# EAGLE design RCboat (EAGLE 9.6.2)
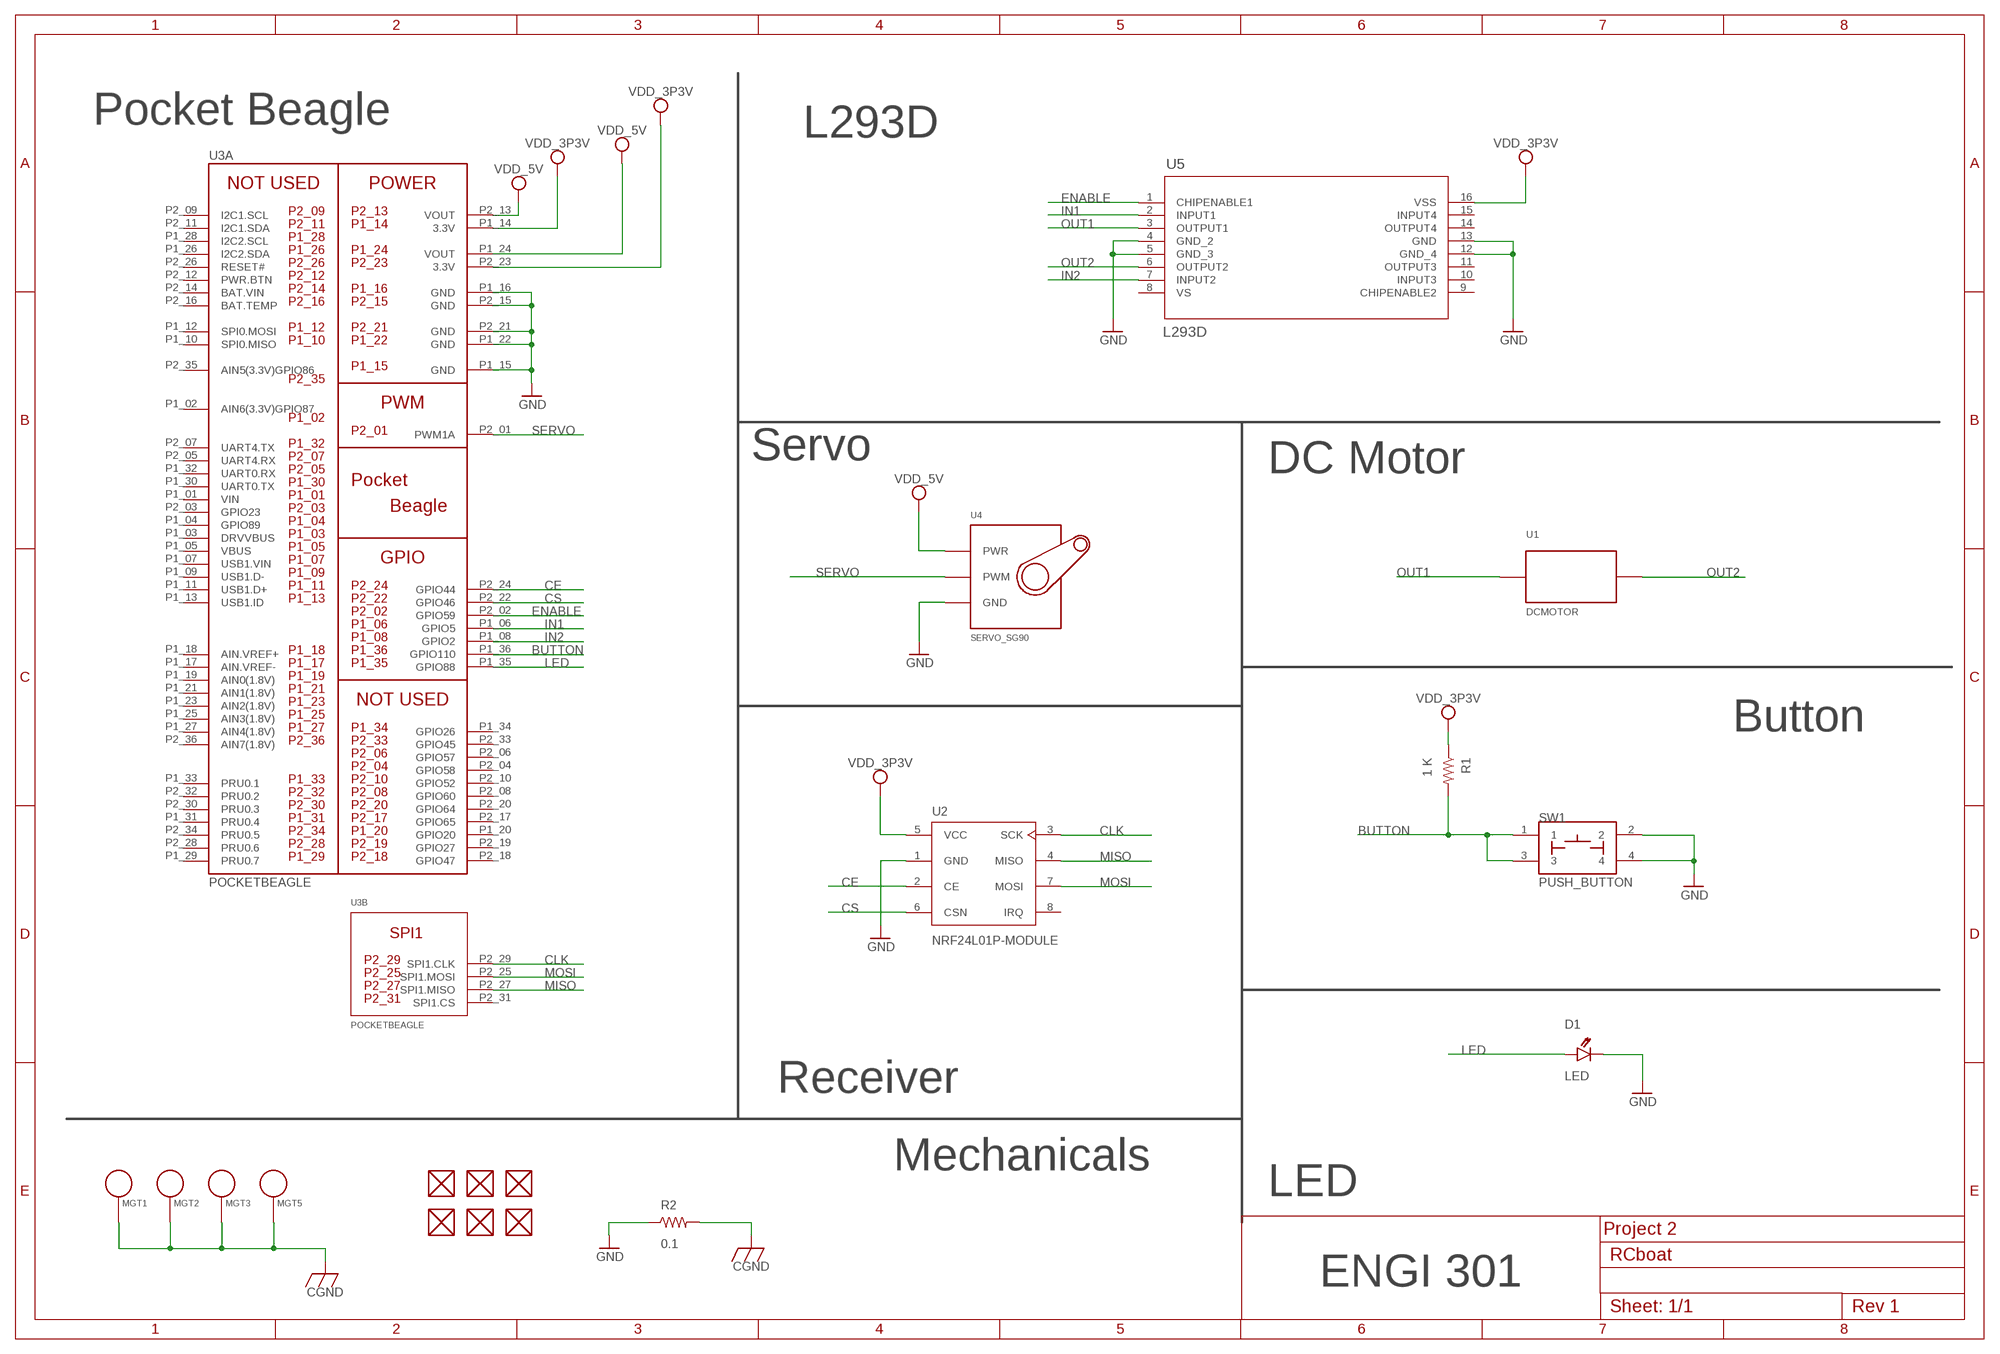
[diagram p0: schematic, sheet 1]

## Parts
D1  LED  [EIA-STD]
FUD1  FIDUCIAL  [FIDUCIAL_40MIL]
FUD2  FIDUCIAL  [FIDUCIAL_40MIL]
FUD3  FIDUCIAL  [FIDUCIAL_40MIL]
FUD4  FIDUCIAL  [FIDUCIAL_40MIL]
FUD5  FIDUCIAL  [FIDUCIAL_40MIL]
FUD6  FIDUCIAL  [FIDUCIAL_40MIL]
MGT1  MOUNTING_HOLE  [MOUNTING_HOLE]
MGT2  MOUNTING_HOLE  [MOUNTING_HOLE]
MGT3  MOUNTING_HOLE  [MOUNTING_HOLE]
MGT5  MOUNTING_HOLE  [MOUNTING_HOLE]
R1  1 K  R_R0603  [R0603]
R2  0.1  R_R0805  [R0805]
SW1  PUSH_BUTTON  [BUTTON_12.5MM]
U1  DCMOTOR  [DCMOTOR]
U2  NRF24L01P-MODULE  [NRF24L01P-MODULE]
U3  POCKETBEAGLE  [POCKETBEAGLE]
U4  SERVO_SG90  [SERVO-X1]
U5  L293D  [POWERDIP-16_STM]

## Nets
BUTTON: R1.2 SW1.1 SW1.3 U3.P1_36(A:GPIO110)
CE: U2.2(CE) U3.P2_24(A:GPIO44)
CGND: MGT1.P$1 MGT2.P$1 MGT3.P$1 MGT5.P$1 R2.2
CLK: U2.3(SCK) U3.P2_29(B:SPI1.CLK)
CS: U2.6(CSN) U3.P2_22(A:GPIO46)
ENABLE: U3.P2_02(A:GPIO59) U5.1(CHIPENABLE1)
GND: D1.CATHODE R2.1 SW1.2 SW1.4 U2.1(GND) U3.P1_15(A:GND) U3.P1_16(A:GND) U3.P1_22(A:GND) U3.P2_15(A:GND) U3.P2_21(A:GND) U4.GND U5.4(GND_2) U5.5(GND_3) U5.12(GND_4) U5.13(GND)
IN1: U3.P1_06(A:GPIO5) U5.2(INPUT1)
IN2: U3.P1_08(A:GPIO2) U5.7(INPUT2)
LED: D1.ANODE U3.P1_35(A:GPIO88)
MISO: U2.4(MISO) U3.P2_27(B:SPI1.MISO)
MOSI: U2.7(MOSI) U3.P2_25(B:SPI1.MOSI)
OUT1: U1.1(V1) U5.3(OUTPUT1)
OUT2: U1.2 U5.6(OUTPUT2)
SERVO: U3.P2_01(A:PWM1A) U4.SIG(PWM)
VDD_3P3V: R1.1 U2.5(VCC) U3.P1_14(A:3.3V) U3.P2_23(A:3.3V) U5.16(VSS)
VDD_5V: U3.P1_24(A:VOUT) U3.P2_13(A:VOUT) U4.PWR
Unconnected: FUD1.P$1 FUD2.P$1 FUD3.P$1 FUD4.P$1 FUD5.P$1 FUD6.P$1 U2.8(IRQ) U3.P1_02(A:AIN6(3.3V)GPIO87) U3.P1_03(A:DRVVBUS) U3.P1_04(A:GPIO89) U3.P1_05(A:VBUS) U3.P1_07(A:USB1.VIN) U3.P1_09(A:USB1.D-) U3.P1_10(A:SPI0.MISO) U3.P1_11(A:USB1.D+) U3.P1_12(A:SPI0.MOSI) U3.P1_13(A:USB1.ID) U3.P1_17(A:AIN.VREF-) U3.P1_18(A:AIN.VREF+) U3.P1_19(A:AIN0(1.8V)) U3.P1_20(A:GPIO20) U3.P1_21(A:AIN1(1.8V)) U3.P1_23(A:AIN2(1.8V)) U3.P1_25(A:AIN3(1.8V)) U3.P1_26(A:I2C2.SDA) U3.P1_27(A:AIN4(1.8V)) U3.P1_28(A:I2C2.SCL) U3.P1_29(A:PRU0.7) U3.P1_30(A:UART0.TX) U3.P1_31(A:PRU0.4) U3.P1_32(A:UART0.RX) U3.P1_33(A:PRU0.1) U3.P1_34(A:GPIO26) U3.P2_03(A:GPIO23) U3.P2_04(A:GPIO58) U3.P2_05(A:UART4.RX) U3.P2_06(A:GPIO57) U3.P2_07(A:UART4.TX) U3.P2_08(A:GPIO60) U3.P2_09(A:I2C1.SCL) U3.P2_10(A:GPIO52) U3.P2_11(A:I2C1.SDA) U3.P2_12(A:PWR.BTN) U3.P2_16(A:BAT.TEMP) U3.P2_17(A:GPIO65) U3.P2_18(A:GPIO47) U3.P2_19(A:GPIO27) U3.P2_20(A:GPIO64) U3.P2_26(A:RESET#) U3.P2_28(A:PRU0.6) U3.P2_30(A:PRU0.3) U3.P2_31(B:SPI1.CS) U3.P2_32(A:PRU0.2) U3.P2_33(A:GPIO45) U3.P2_34(A:PRU0.5) U3.P2_35(A:AIN5(3.3V)GPIO86) U3.P2_36(A:AIN7(1.8V)) U5.9(CHIPENABLE2) U5.10(INPUT3) U5.11(OUTPUT3) U5.14(OUTPUT4) U5.15(INPUT4)

## Notes on the sheet
- Pocket Beagle | L293D
- Servo | DC Motor
- Button
- Receiver
- Mechanicals
- LED
- Project 2
- ENGI 301
- 1/1

## Power pins joined to a net without a drawn wire
BAT.VIN: U3.P2_14(A:BAT.VIN)
VIN: U3.P1_01(A:VIN)
VS: U5.8(VS)

## Library data of the parts
D1 = Project2:LED: EIA-STD LED; LTST-C191TBKT
FUD1-FUD6 = Project2:FIDUCIAL
MGT1-MGT3 MGT5 = Project2:MOUNTING_HOLE: Chassis Mounting Hole w/GND connection ability
R1 R2 = Project2:R_: RESISTOR, American symbol
SW1 = Project2:PUSH_BUTTON
U1 = Project2:DCMOTOR
U2 = Project2:NRF24L01P-MODULE: NRF24L01P-MODULE
U3 = Project2:POCKETBEAGLE: Pocketbeagle
U4 = Project2:SERVO_SG90: 180 degree roatation SG90 Servo
U5 = Project2:L293D: L293D Motor Controller for DC motor; COPYRIGHT: Copyright (C) 2021 Ultra Librarian. All rights reserved.; MANUFACTURER_PART_NUMBER: L293D; MFR_NAME: STMicroelectronics

## Board
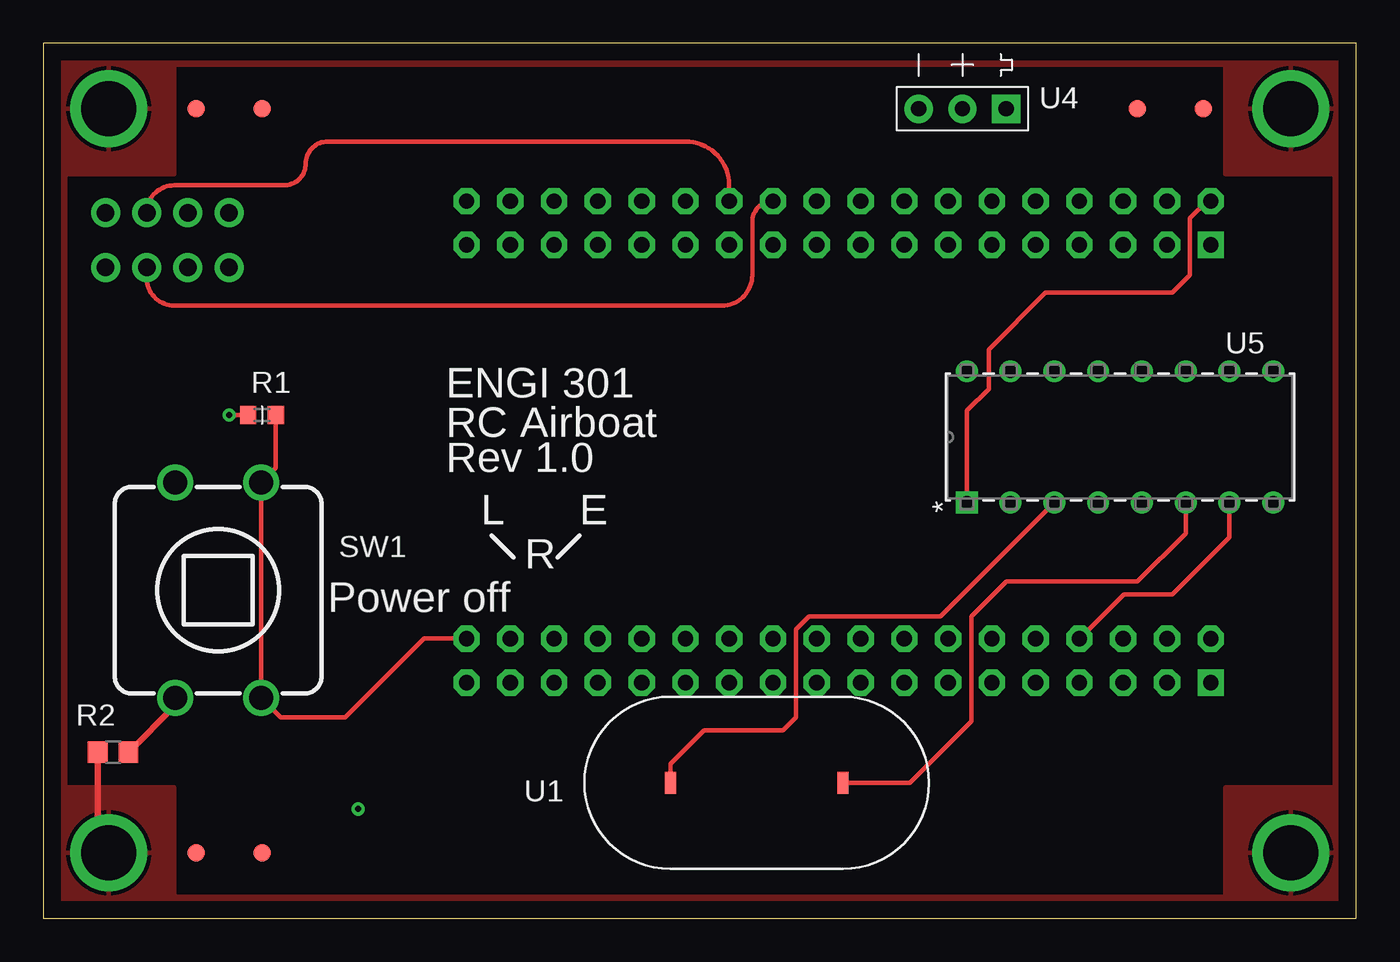
[diagram p1: board, top side]
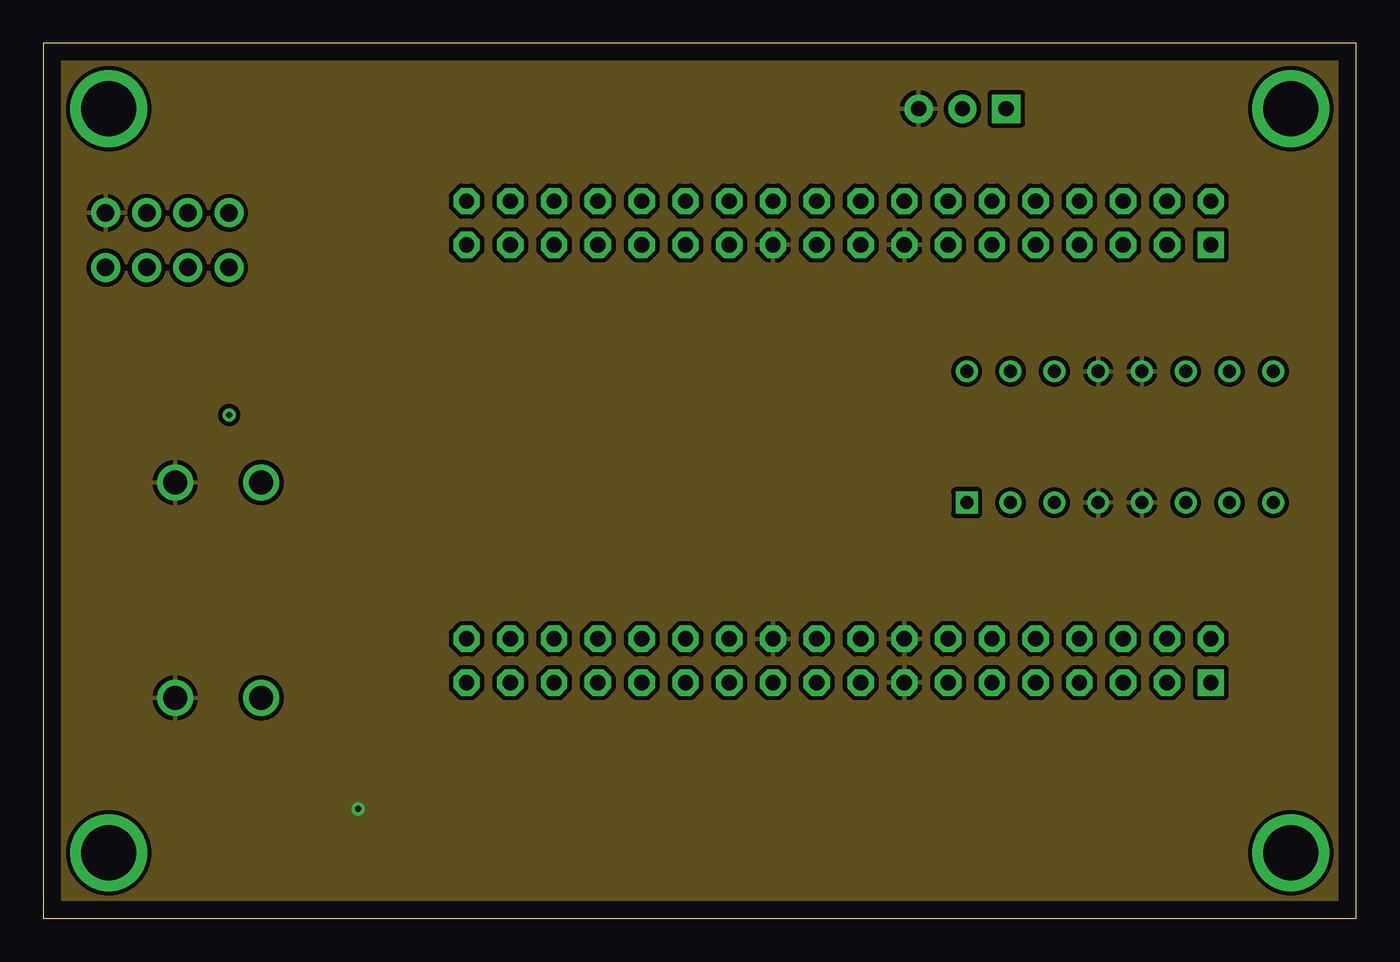
[diagram p2: board, inner layer Route2]
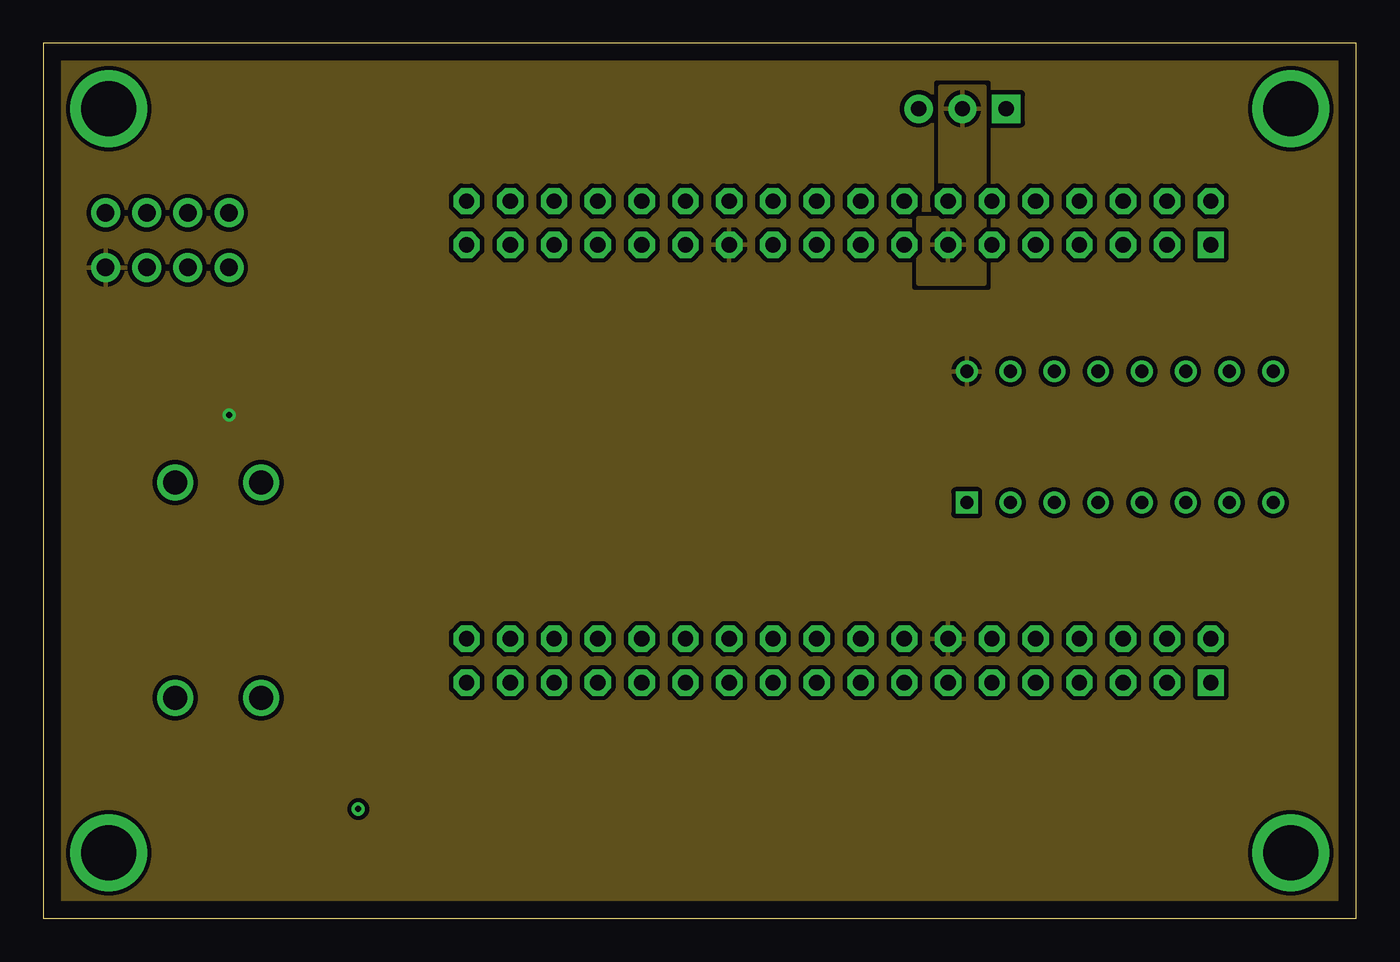
[diagram p3: board, inner layer Route15]
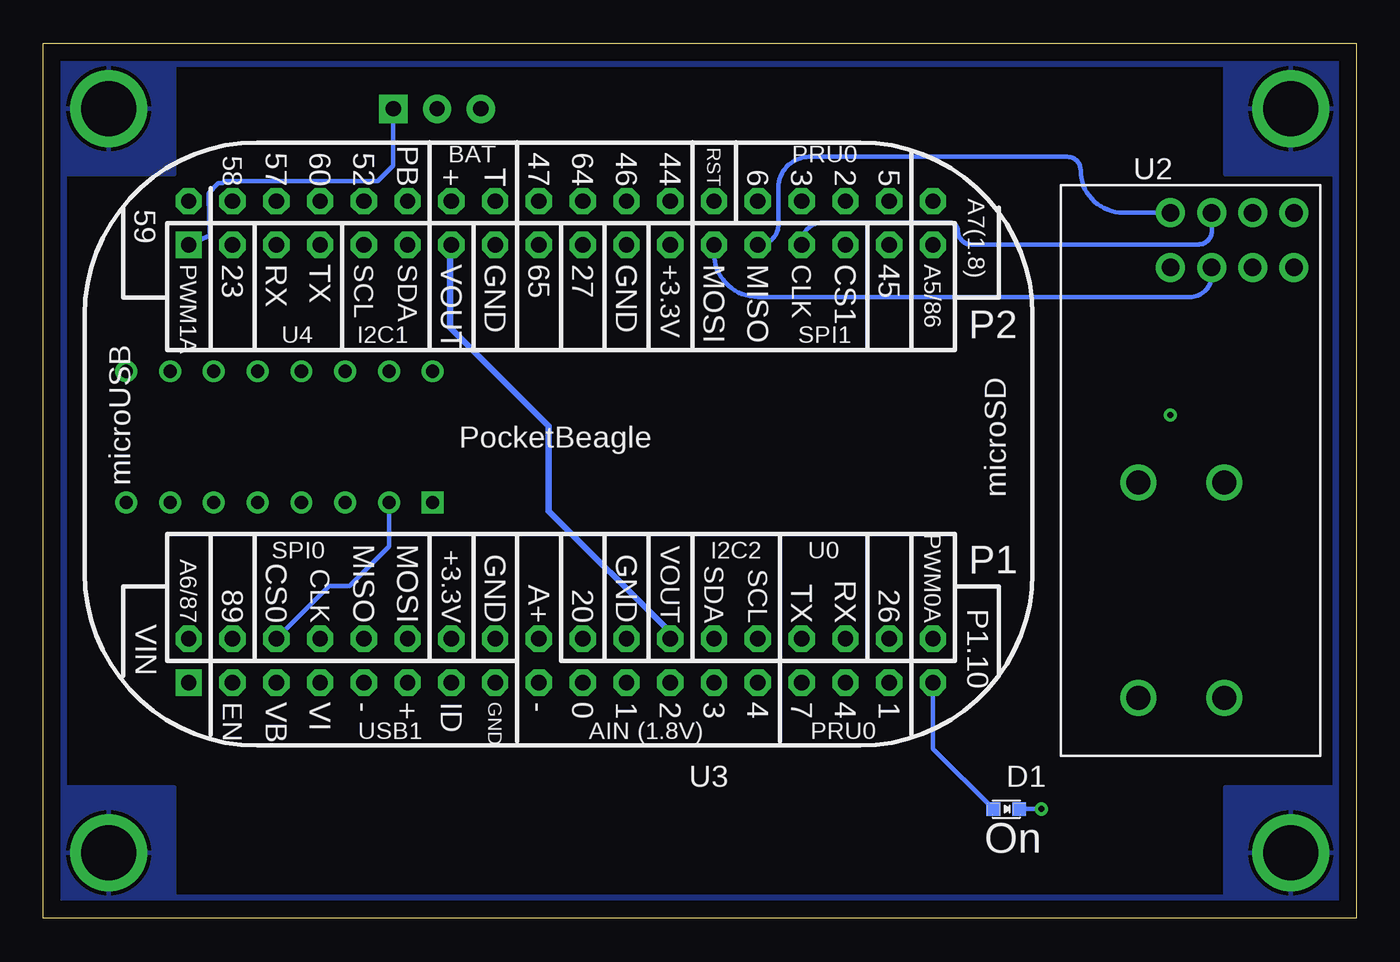
[diagram p4: board, bottom side, seen from below]

Size 76.2 x 50.8 mm. Coordinates in mm from the lower left corner, seen from the top.
Outline: 0,0 76.2,0 76.2,50.8 0,50.8 0,0
Copper layers (1+2*15+16): Top 0.035mm / dielectric 1.5mm / Route2 0.035mm / dielectric 0.15mm / Route15 0.035mm / dielectric 0.2mm / Bottom 0.035mm
Design rules "default *": minimum track width 6mil, minimum drill 0.35mm, track to track 10mil, track to pad 10mil, pad to pad 10mil, via to via 10mil, smd to smd 6mil, copper to edge 40mil, drill to drill 6mil, minimum pad ring 10mil, minimum via ring 8mil, stop-mask expansion 4mil, vias tented up to drill 0mil, thermal gap 10mil

### Footprints (pad centres in the part's own frame; a part is rotated, then mirrored left to right if it is on the bottom)
EIA-STD = smd 0.8 x 0.8: ANODE -0.75,0; CATHODE 0.75,0
FIDUCIAL_40MIL = smd 1.016 x 1.016: P$1 0,0
MOUNTING_HOLE = drill 3.175 pad 4.445: P$1 0,0
R0603 = smd 0.95 x 1.031: 1 -0.8,0; 2 0.8,0
R0805 = smd 1.143 x 1.27: 1 -0.889,0; 2 0.889,0
BUTTON_12.5MM = drill 1.4: 1 -6.25,2.5; 2 -6.25,-2.5; 3 6.25,2.5; 4 6.25,-2.5
DCMOTOR = smd 1.27 x 0.635: 1 0,5; 2 0,-5
NRF24L01P-MODULE = drill 1.02 pad 1.676: 1 1.59,13.515; 2 1.59,11.13; 3 1.59,8.745; 4 1.59,6.36; 5 4.77,13.515; 6 4.77,11.13; 7 4.77,8.745; 8 4.77,6.36
POCKETBEAGLE = drill 0.889 pad 1.524 square: P1_01 7.18,2.26; P2_01 7.18,27.66 | drill 0.889 pad 1.524 octagon: P1_02 7.18,4.8; P1_03 9.72,2.26; P1_04 9.72,4.8; P1_05 12.26,2.26; P1_06 12.26,4.8; P1_07 14.8,2.26; P1_08 14.8,4.8; P1_09 17.34,2.26; P1_10 17.34,4.8; P1_11 19.88,2.26; P1_12 19.88,4.8; P1_13 22.42,2.26; P1_14 22.42,4.8; P1_15 24.96,2.26; P1_16 24.96,4.8; P1_17 27.5,2.26; P1_18 27.5,4.8; P1_19 30.04,2.26; P1_20 30.04,4.8; P1_21 32.58,2.26; P1_22 32.58,4.8; P1_23 35.12,2.26; P1_24 35.12,4.8; P1_25 37.66,2.26; P1_26 37.66,4.8; P1_27 40.2,2.26; P1_28 40.2,4.8; P1_29 42.74,2.26; P1_30 42.74,4.8; P1_31 45.28,2.26; P1_32 45.28,4.8; P1_33 47.82,2.26; P1_34 47.82,4.8; P1_35 50.36,2.26; P1_36 50.36,4.8; P2_02 7.18,30.2; P2_03 9.72,27.66; P2_04 9.72,30.2; P2_05 12.26,27.66; P2_06 12.26,30.2; P2_07 14.8,27.66; P2_08 14.8,30.2; P2_09 17.34,27.66; P2_10 17.34,30.2; P2_11 19.88,27.66; P2_12 19.88,30.2; P2_13 22.42,27.66; P2_14 22.42,30.2; P2_15 24.96,27.66; P2_16 24.96,30.2; P2_17 27.5,27.66; P2_18 27.5,30.2; P2_19 30.04,27.66; P2_20 30.04,30.2; P2_21 32.58,27.66; P2_22 32.58,30.2; P2_23 35.12,27.66; P2_24 35.12,30.2; P2_25 37.66,27.66; P2_26 37.66,30.2; P2_27 40.2,27.66; P2_28 40.2,30.2; P2_29 42.74,27.66; P2_30 42.74,30.2; P2_31 45.28,27.66; P2_32 45.28,30.2; P2_33 47.82,27.66; P2_34 47.82,30.2; P2_35 50.36,27.66; P2_36 50.36,30.2
SERVO-X1 = drill 0.889 pad 1.651: GND 0,-2.54; PWR 0,0 | drill 0.889 pad 1.651 square: SIG 0,2.54
POWERDIP-16_STM = drill 0.762 pad 1.27 square: 1 0,0 | drill 0.762 pad 1.27: 2 0,-2.54; 3 0,-5.08; 4 0,-7.62; 5 0,-10.16; 6 0,-12.7; 7 0,-15.24; 8 0,-17.78; 9 7.62,-17.78; 10 7.62,-15.24; 11 7.62,-12.7; 12 7.62,-10.16; 13 7.62,-7.62; 14 7.62,-5.08; 15 7.62,-2.54; 16 7.62,0

### Placement (x,y rotation side)
D1  20.32,6.35 0 bottom
FUD1  67.31,46.99 0 top
FUD2  8.89,46.99 0 top
FUD3  8.89,3.81 0 top
FUD4  12.7,46.99 0 top
FUD5  12.7,3.81 0 top
FUD6  63.5,46.99 0 top
MGT1  3.81,3.81 0 top
MGT2  3.81,46.99 0 top
MGT3  72.39,3.81 0 top
MGT5  72.39,46.99 0 top
R1  12.7,29.21 0 top
R2  4.06,9.65 180 top
SW1  10.16,19.05 270 top
U1  41.4,7.87 90 top
U2  17.14,42.55 270 bottom
U3  74.93,11.43 0 bottom
U4  53.34,46.99 270 top
U5  53.59,24.13 90 top

### Tracks (layer width: path | path; a pad name or v marks a point on that pad's centre or on a via)
BUTTON
  Top 0.254: R1.2 13.5,26.14 SW1.1 SW1.3 13.78,11.68 17.53,11.68 22.1,16.26 24.54,16.26 U3.P1_36
CE
  Top 0.254: U2.2 arc-90 7.61,42.55 13.97,42.55 arc90 15.24,43.81 arc-90 16.51,45.09 37.27,45.09 arc-90 39.81,42.55 U3.P2_24
CGND
  Top 0.381: 3.17,4.45 R2.2
  Top 0.508: MGT1.P$1 3.17,4.45
  pour Top: -1.27,25.4 -1.27,52.07 77.47,52.07 77.47,25.4 74.93,25.4 74.93,43.18 68.58,43.18 68.58,49.53 7.62,49.53 7.62,43.18 1.27,43.18 1.27,25.4
  pour Top: 1.27,25.4 -1.27,25.4 -1.27,-1.27 77.47,-1.27 77.47,25.4 74.93,25.4 74.93,7.62 68.58,7.62 68.58,1.27 7.62,1.27 7.62,7.62 1.27,7.62
  pour Bottom: 74.93,25.4 77.47,25.4 77.47,-1.27 -1.27,-1.27 -1.27,25.4 1.27,25.4 1.27,7.62 7.62,7.62 7.62,1.27 68.58,1.27 68.58,7.62 74.93,7.62
  pour Bottom: 74.93,25.4 77.47,25.4 77.47,52.07 -1.27,52.07 -1.27,25.4 1.27,25.4 1.27,43.18 7.62,43.18 7.62,49.53 68.58,49.53 68.58,43.18 74.93,43.18
CLK
  Bottom 0.254: U2.3 8.4,39.86 arc90 9.14,39.12 22.35,39.12 arc90 23.11,39.88 arc-90 23.62,40.39 30.99,40.39 arc-90 32.19,39.18 U3.P2_29
CS
  Top 0.254: U2.6 6.01,37.16 arc90 7.62,35.56 39.37,35.56 arc90 41.15,37.34 41.15,40.43 arc-90 U3.P2_22
ENABLE
  Top 0.254: U5.1 53.59,29.46 54.86,30.73 54.86,33.02 58.17,36.32 65.53,36.32 66.55,37.34 66.55,40.64 67.54,41.63 U3.P2_02
GND  (via drill 0.35 pad 0.61)
  Top 0.381: R2.1 7.66,12.36 SW1.4
  Bottom 0.254: D1.CATHODE v18.29,6.35
  pour Route2: -2.54,-2.54 -2.54,53.34 78.74,53.34 78.74,-2.54
IN1
  Bottom 0.254: U3.P1_06 59.6,19.3 58.42,19.3 56.13,21.59 U5.2
IN2
  Top 0.254: U3.P1_08 62.7,18.8 65.53,18.8 68.83,22.1 U5.7
LED
  Bottom 0.254: D1.ANODE 24.57,9.85 U3.P1_35
MISO
  Bottom 0.254: U2.4 13.52,40.95 arc90 16,43.43 arc-90 16.76,44.2 31.75,44.2 arc-90 33.53,42.42 33.53,40.29 arc90 U3.P2_27
MOSI
  Bottom 0.254: U2.7 8.4,37.32 arc90 9.65,36.07 34.73,36.07 arc90 37.27,38.61 U3.P2_25
OUT1
  Top 0.254: U1.1 36.4,8.97 38.35,10.92 42.93,10.92 43.69,11.68 43.69,16.76 44.45,17.53 52.07,17.53 U5.3
OUT2
  Top 0.254: U5.6 66.29,22.35 63.5,19.56 55.88,19.56 53.85,17.53 53.85,11.43 50.29,7.87 U1.2
SERVO
  Bottom 0.254: U4.SIG 55.88,43.69 56.8,42.77 65.68,42.77 65.78,42.67 66.04,42.67 66.61,42.1 66.61,41.91 66.55,39.62 U3.P2_01
VDD_3P3V  (via drill 0.35 pad 0.61)
  Top 0.254: R1.1 v10.79,29.21
  pour Route15 (rank 6): -5.08,55.88 81.28,55.88 81.28,-5.08 -5.08,-5.08
VDD_5V
  Bottom 0.381: U3.P1_24 39.81,16.6 46.86,23.66 46.86,28.57 52.58,34.29 52.58,39.02
  Bottom 0.508: 52.58,39.02 U3.P2_13
  pour Route15: 50.8,36.83 53.34,36.83 54.61,36.83 54.61,48.26 52.07,48.26 52.07,40.64 50.8,40.64

### Text on the board
tPlace: ENGI 301 | RC Airboat | Rev 1.0 | L | E | R | Power off
bPlace: On